# EAGLE design capacitive_switch (EAGLE 9.6.0)

## Sheet 1 of 2
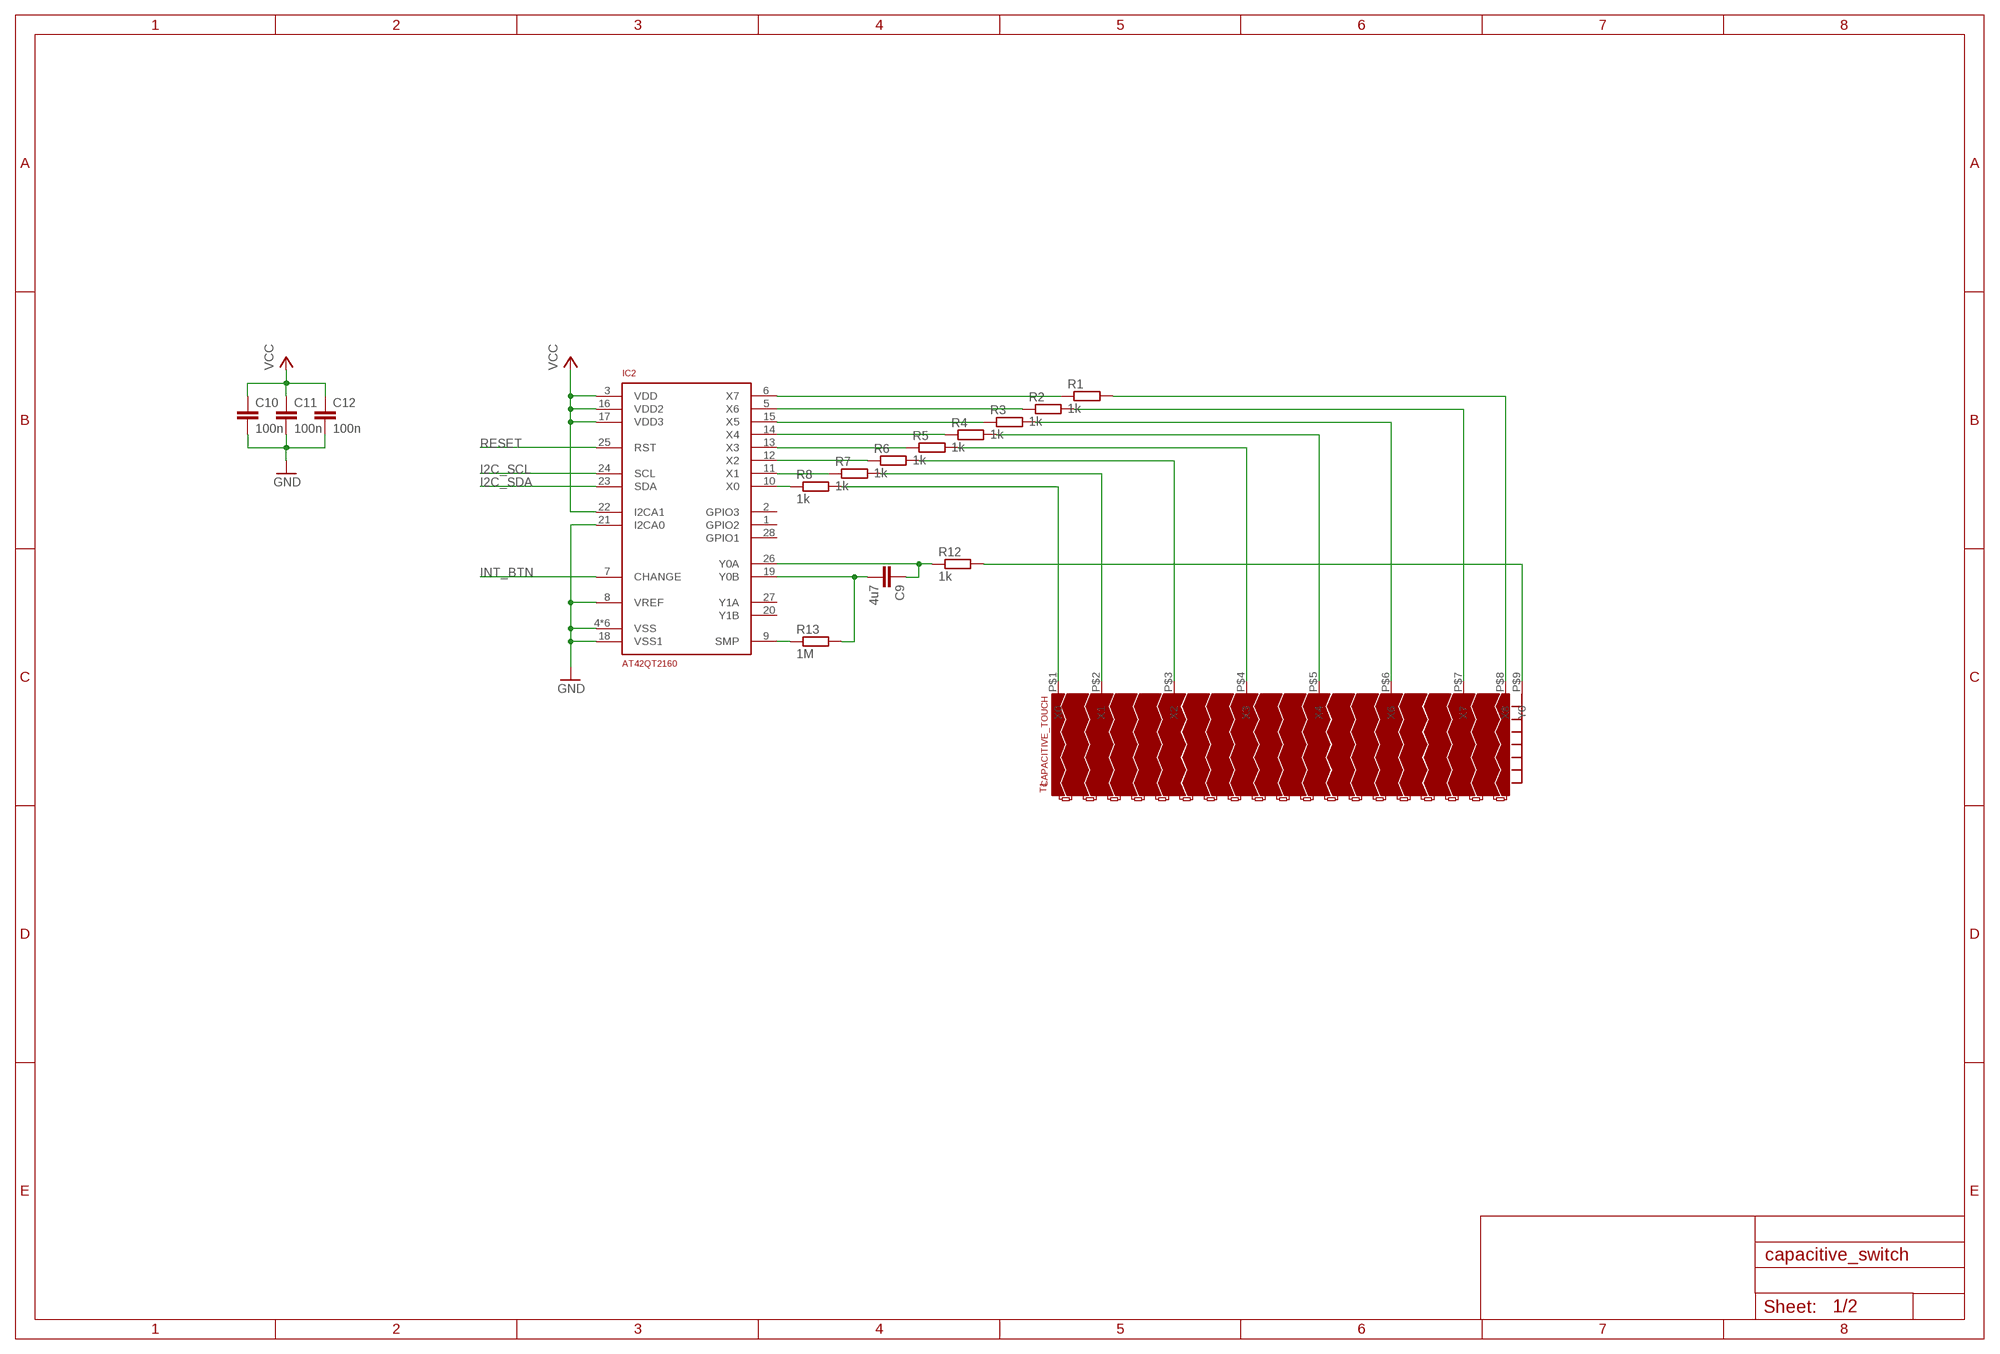
[diagram p0: schematic, sheet 1]

### Parts
C9  4u7  CAPACITOR0805  [C0805]
C10  100n  CAPACITOR0805  [C0805]
C11  100n  CAPACITOR0805  [C0805]
C12  100n  CAPACITOR0805  [C0805]
IC2  AT42QT2160  [QFN28_0.45MM_4X4MM]
R1  1k  RESISTOR0805  [R0805]
R2  1k  RESISTOR0805  [R0805]
R3  1k  RESISTOR0805  [R0805]
R4  1k  RESISTOR0805  [R0805]
R5  1k  RESISTOR0805  [R0805]
R6  1k  RESISTOR0805  [R0805]
R7  1k  RESISTOR0805  [R0805]
R8  1k  RESISTOR0805  [R0805]
R12  1k  RESISTOR0805  [R0805]
R13  1M  RESISTOR0805  [R0805]
T1  CAPACITIVE_TOUCH  [90X20_CAPACITIVE_TOUCH]

### Nets
GND: C10.2 C11.2 C12.2 IC2.4(VSS) IC2.8(VREF) IC2.18(VSS1) IC2.21(I2CA0) IC2.29(VSS) IC2.P$1(VSS) IC2.P$2(VSS) IC2.P$3(VSS) IC2.P$4(VSS) ; also sheet 2
I2C_SCL: IC2.24(SCL) ; also sheet 2
I2C_SDA: IC2.23(SDA) ; also sheet 2
INT_BTN: IC2.7(CHANGE) ; also sheet 2
N$2: R8.2 T1.P$1(X0)
N$7: R7.2 T1.P$2(X1)
N$8: R6.2 T1.P$3(X2)
N$9: R5.2 T1.P$4(X3)
N$10: R4.2 T1.P$5(X4)
N$11: R3.2 T1.P$6(X6)
N$12: R2.2 T1.P$7(X7)
N$13: R1.2 T1.P$8(X8)
N$14: R12.2 T1.P$9(Y0)
N$15: C9.1 IC2.26(Y0A) R12.1
N$25: IC2.10(X0) R8.1
N$26: IC2.11(X1) R7.1
N$27: IC2.12(X2) R6.1
N$28: IC2.13(X3) R5.1
N$29: IC2.14(X4) R4.1
N$30: IC2.15(X5) R3.1
N$31: IC2.5(X6) R2.1
N$32: IC2.6(X7) R1.1
N$34: C9.2 IC2.19(Y0B) R13.2
N$36: IC2.9(SMP) R13.1
RESET: IC2.25(RST) ; also sheet 2
VCC: C10.1 C11.1 C12.1 IC2.3(VDD) IC2.16(VDD2) IC2.17(VDD3) IC2.22(I2CA1) ; also sheet 2
Unconnected: IC2.1(GPIO2) IC2.2(GPIO3) IC2.20(Y1B) IC2.27(Y1A) IC2.28(GPIO1)

## Sheet 2 of 2
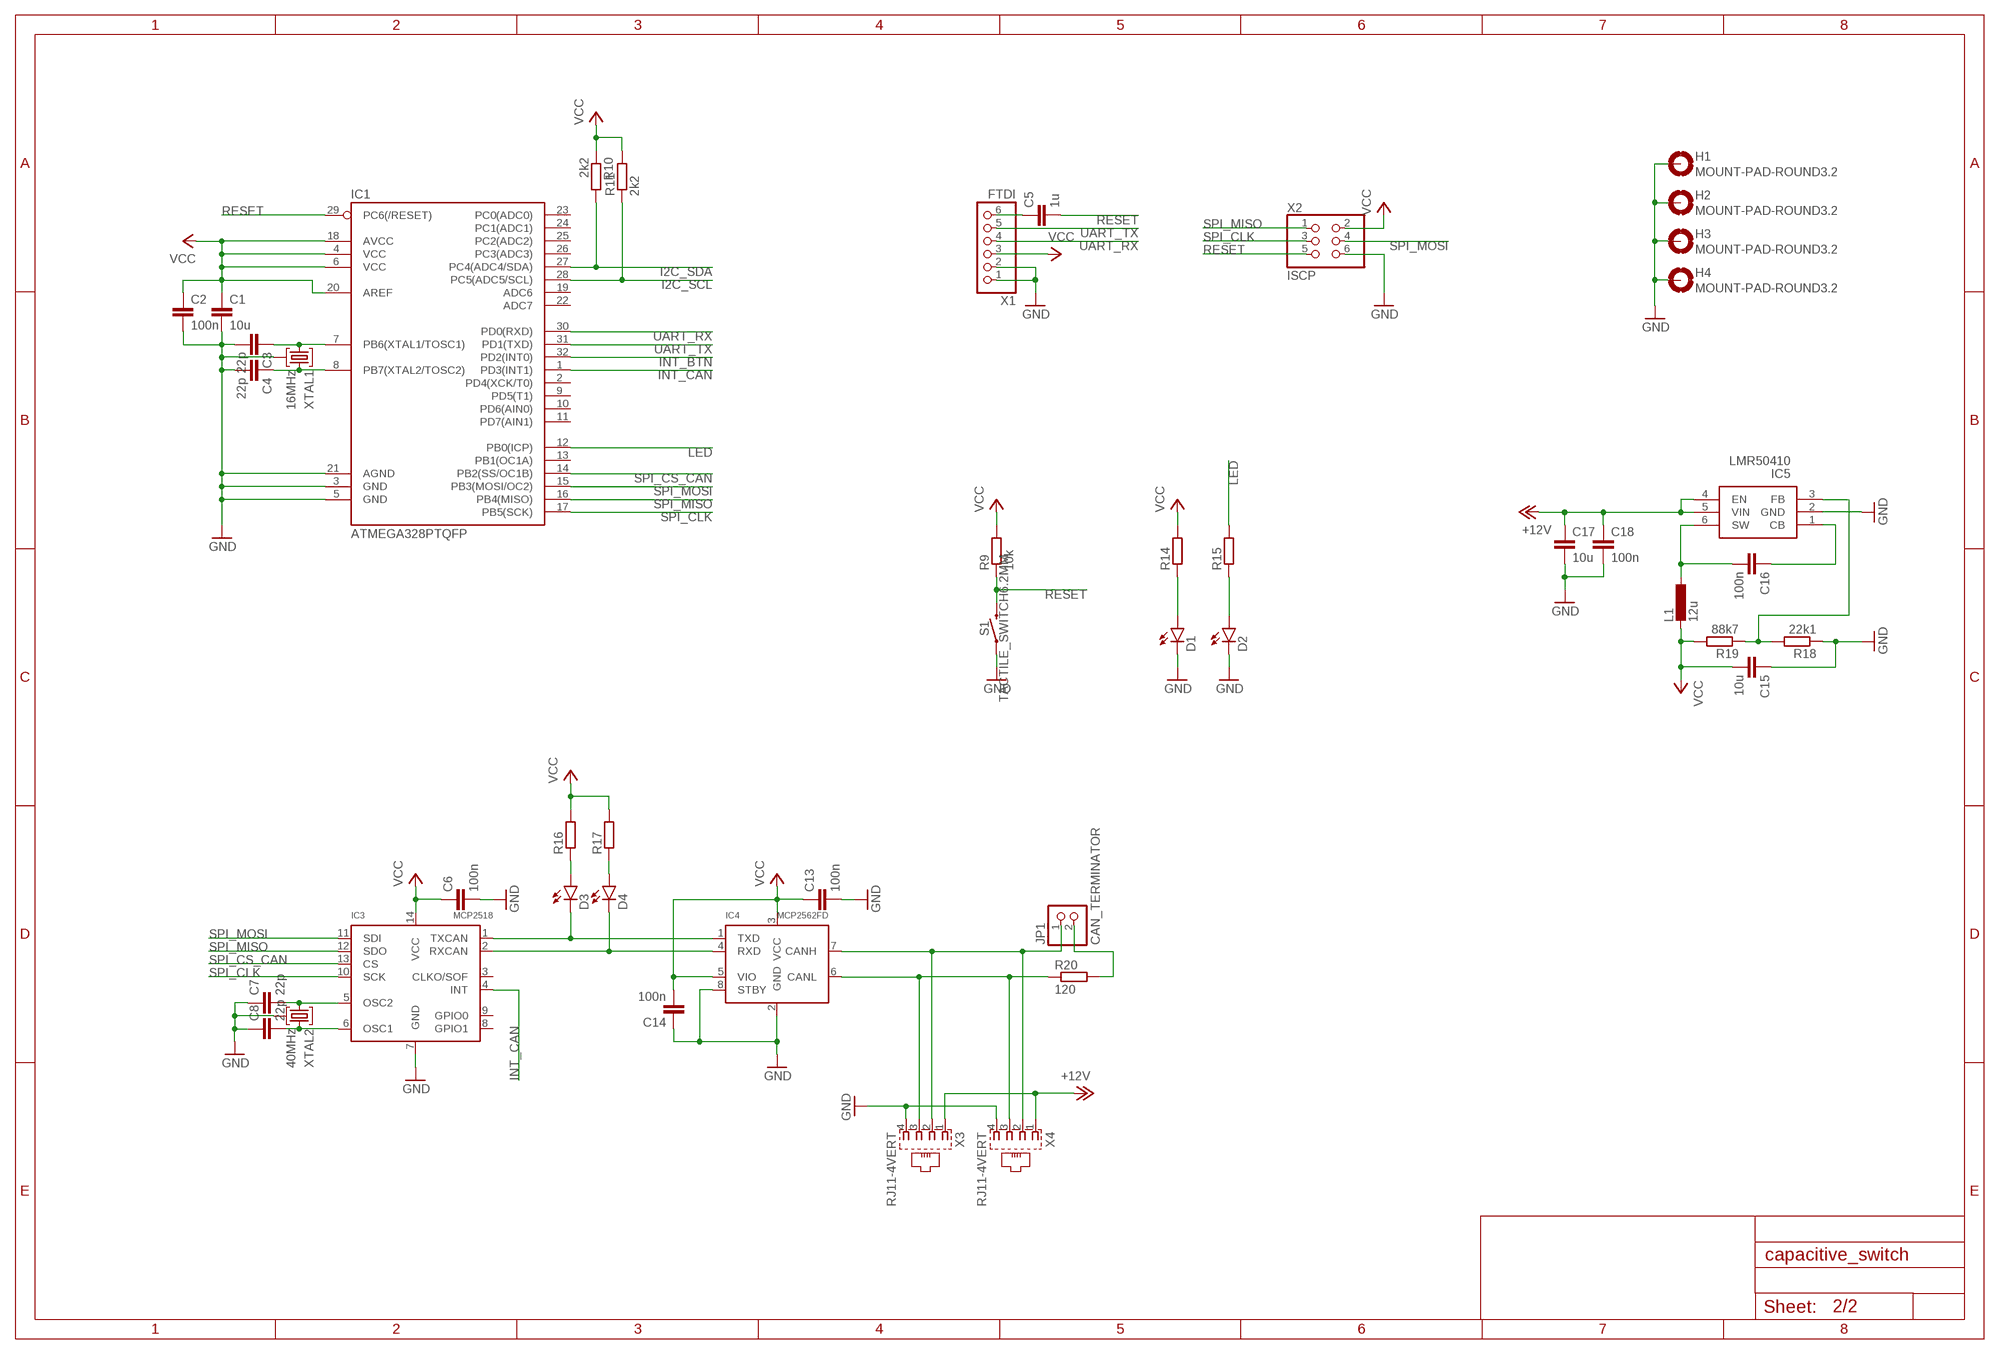
[diagram p1: schematic, sheet 2]

### Parts
C1  10u  CAPACITOR1206  [C1206]
C2  100n  CAPACITOR0805  [C0805]
C3  22p  CAPACITOR0805  [C0805]
C4  22p  CAPACITOR0805  [C0805]
C5  1u  CAPACITOR0805  [C0805]
C6  100n  CAPACITOR0805  [C0805]
C7  22p  CAPACITOR0805  [C0805]
C8  22p  CAPACITOR0805  [C0805]
C13  100n  CAPACITOR0805  [C0805]
C14  100n  CAPACITOR0805  [C0805]
C15  10u  CAPACITOR1206  [C1206]
C16  100n  CAPACITOR0805  [C0805]
C17  10u  CAPACITOR1206  [C1206]
C18  100n  CAPACITOR0805  [C0805]
D1  LED1206  [CHIPLED_1206]
D2  LED1206  [CHIPLED_1206]
D3  LED1206  [CHIPLED_1206]
D4  LED1206  [CHIPLED_1206]
H1  MOUNT-PAD-ROUND3.2  [3,2-PAD]
H2  MOUNT-PAD-ROUND3.2  [3,2-PAD]
H3  MOUNT-PAD-ROUND3.2  [3,2-PAD]
H4  MOUNT-PAD-ROUND3.2  [3,2-PAD]
IC1  ATMEGA328PTQFP  [TQFP32_0.8MM_7X7MM]
IC3  MCP2518  MCP2518FDSO14  [SO14]
IC4  MCP2562FD  MCP2562FDSO08  [SO08]
IC5  LMR50410  [SOT23-6]
JP1  CAN_TERMINATOR  PINHD-1X2  [1X02]
L1  12u  INDUCTOR7.3MM  [L_7.3MM]
R9  10k  RESISTOR0805  [R0805]
R10  2k2  RESISTOR0805  [R0805]
R11  2k2  RESISTOR0805  [R0805]
R14  RESISTOR0805  [R0805]
R15  RESISTOR0805  [R0805]
R16  RESISTOR0805  [R0805]
R17  RESISTOR0805  [R0805]
R18  22k1  RESISTOR0805  [R0805]
R19  88k7  RESISTOR0805  [R0805]
R20  120  RESISTOR0805  [R0805]
S1  TACTILE_SWITCH6.2MM  [TACTILE_SWITCH_SMD_6.2MM]
X1  FTDI  PINHD-1X6  [1X06]
X2  ISCP  PINHD-2X3  [2X03]
X3  RJ11-4VERT  [RJ11-4_VERT]
X4  RJ11-4VERT  [RJ11-4_VERT]
XTAL1  16MHz  CRYSTAL_GND5X3.2  [XTAL_5.0X3.2_4]
XTAL2  40MHz  CRYSTAL_GND5X3.2  [XTAL_5.0X3.2_4]

### Nets
+12V: C17.1 C18.1 IC5.4(EN) IC5.5(VIN) X3.1 X4.1
GND: C1.2 C2.2 C3.2 C4.2 C6.2 C7.1 C8.1 C13.2 C14.1 C15.1 C17.2 C18.2 D1.C D2.C H1.B3,2(MOUNT) H1.P$1(MOUNT) H1.P$2(MOUNT) H1.P$3(MOUNT) H1.P$4(MOUNT) H1.P$5(MOUNT) H1.P$6(MOUNT) H1.P$7(MOUNT) H1.P$8(MOUNT) H2.B3,2(MOUNT) H2.P$1(MOUNT) H2.P$2(MOUNT) H2.P$3(MOUNT) H2.P$4(MOUNT) H2.P$5(MOUNT) H2.P$6(MOUNT) H2.P$7(MOUNT) H2.P$8(MOUNT) H3.B3,2(MOUNT) H3.P$1(MOUNT) H3.P$2(MOUNT) H3.P$3(MOUNT) H3.P$4(MOUNT) H3.P$5(MOUNT) H3.P$6(MOUNT) H3.P$7(MOUNT) H3.P$8(MOUNT) H4.B3,2(MOUNT) H4.P$1(MOUNT) H4.P$2(MOUNT) H4.P$3(MOUNT) H4.P$4(MOUNT) H4.P$5(MOUNT) H4.P$6(MOUNT) H4.P$7(MOUNT) H4.P$8(MOUNT) IC1.3(GND) IC1.5(GND) IC1.21(AGND) IC3.7(GND) IC4.2(GND) IC4.8(STBY) IC5.2(GND) R18.1 S1.A1 S1.A2 X1.1 X1.2 X2.6 X3.4 X4.4 XTAL1.2 XTAL1.4 XTAL2.2 XTAL2.4 ; also sheet 1
I2C_SCL: IC1.28(PC5(ADC5/SCL)) R11.1 ; also sheet 1
I2C_SDA: IC1.27(PC4(ADC4/SDA)) R10.2 ; also sheet 1
INT_BTN: IC1.32(PD2(INT0)) ; also sheet 1
INT_CAN: IC1.1(PD3(INT1)) IC3.4(INT)
LED: IC1.12(PB0(ICP)) R15.2
N$1: D3.A R16.1
N$3: C3.1 IC1.7(PB6(XTAL1/TOSC1)) XTAL1.1
N$4: C4.1 IC1.8(PB7(XTAL2/TOSC2)) XTAL1.3
N$5: D4.A R17.1
N$6: C5.1 X1.6
N$16: IC4.6(CANL) R20.1 X3.3 X4.3
N$17: IC4.7(CANH) JP1.1 X3.2 X4.2
N$18: D3.C IC3.1(TXCAN) IC4.1(TXD)
N$19: D4.C IC3.2(RXCAN) IC4.4(RXD)
N$20: C7.2 IC3.5(OSC2) XTAL2.1
N$21: C8.2 IC3.6(OSC1) XTAL2.3
N$22: D1.A R14.1
N$23: D2.A R15.1
N$24: JP1.2 R20.2
N$125: C16.2 IC5.6(SW) L1.1
N$126: C16.1 IC5.1(CB)
N$127: IC5.3(FB) R18.2 R19.1
RESET: C5.2 IC1.29(PC6(/RESET)) R9.1 S1.B1 S1.B2 X2.5 ; also sheet 1
SPI_CLK: IC1.17(PB5(SCK)) IC3.10(SCK) X2.3
SPI_CS_CAN: IC1.14(PB2(SS/OC1B)) IC3.13(CS)
SPI_MISO: IC1.16(PB4(MISO)) IC3.12(SDO) X2.1
SPI_MOSI: IC1.15(PB3(MOSI/OC2)) IC3.11(SDI) X2.4
UART_RX: IC1.30(PD0(RXD)) X1.4
UART_TX: IC1.31(PD1(TXD)) X1.5
VCC: C1.1 C2.1 C6.1 C13.1 C14.2 C15.2 IC1.4(VCC) IC1.6(VCC) IC1.18(AVCC) IC1.20(AREF) IC3.14(VCC) IC4.3(VCC) IC4.5(VIO) L1.2 R9.2 R10.1 R11.2 R14.2 R16.2 R17.2 R19.2 X1.3 X2.2 ; also sheet 1
Unconnected: IC1.2(PD4(XCK/T0)) IC1.9(PD5(T1)) IC1.10(PD6(AIN0)) IC1.11(PD7(AIN1)) IC1.13(PB1(OC1A)) IC1.19(ADC6) IC1.22(ADC7) IC1.23(PC0(ADC0)) IC1.24(PC1(ADC1)) IC1.25(PC2(ADC2)) IC1.26(PC3(ADC3)) IC3.3(CLKO/SOF) IC3.8(GPIO1) IC3.9(GPIO0)

## Library data of the parts
C1-C18 = SMD:CAPACITOR
D1-D4 = SMD:LED
H1-H4 = THT:MOUNT-PAD-ROUND: MOUNTING PAD, round
IC1 = SMD:ATMEGA328P
IC2 = SMD:AT42QT2160
IC3 = SMD:MCP2518FD
IC4 = SMD:MCP2562FD
IC5 = SMD:LMR50410
JP1 = THT:PINHD-1X2: PIN HEADER
L1 = SMD:INDUCTOR
R1-R20 = SMD:RESISTOR
S1 = SMD:TACTILE_SWITCH
T1 = SMD:CAPACITIVE_TOUCH
X1 = THT:PINHD-1X6: PIN HEADER
X2 = THT:PINHD-2X3: PIN HEADER
X3 X4 = THT:RJ11-4
XTAL1 XTAL2 = SMD:CRYSTAL_GND

## Board
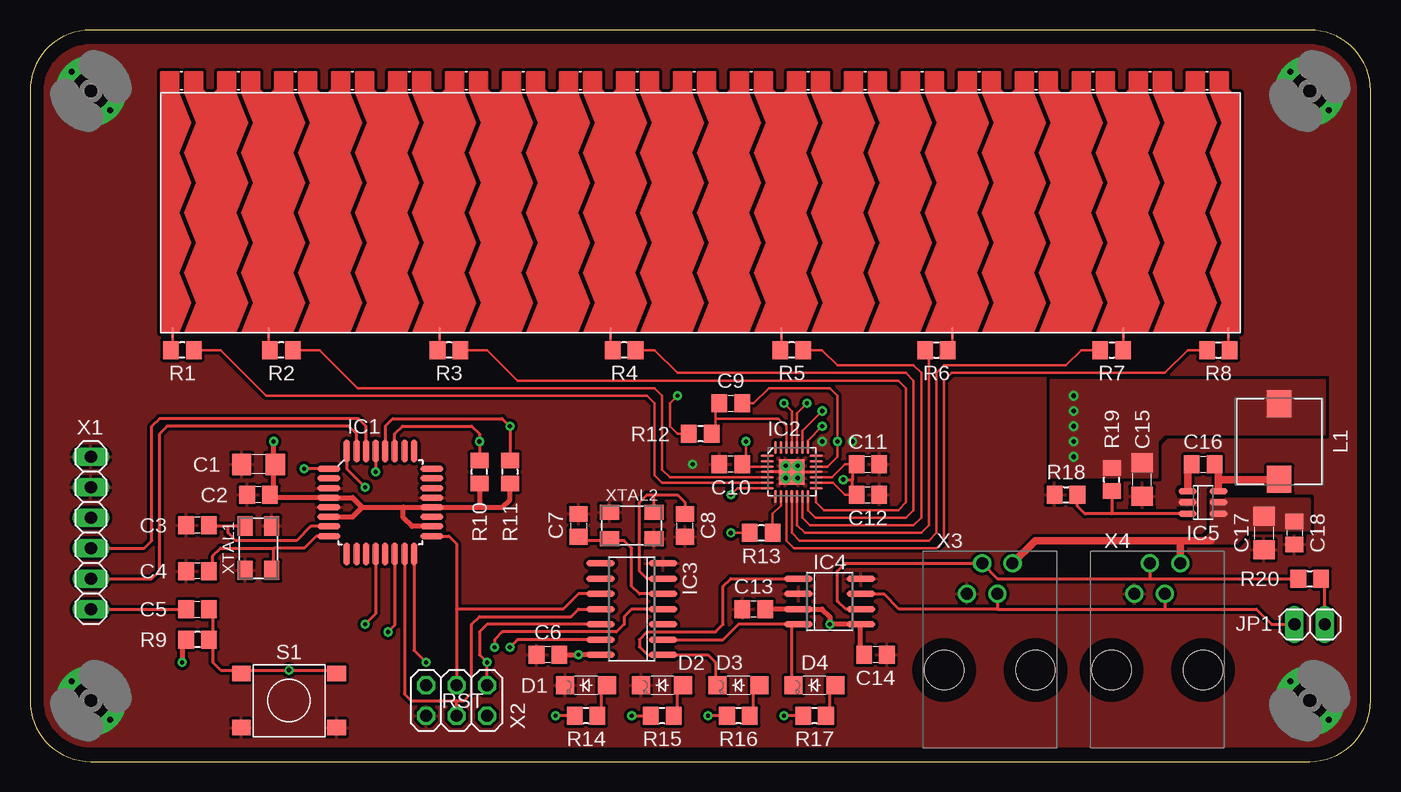
[diagram p2: board, top side]
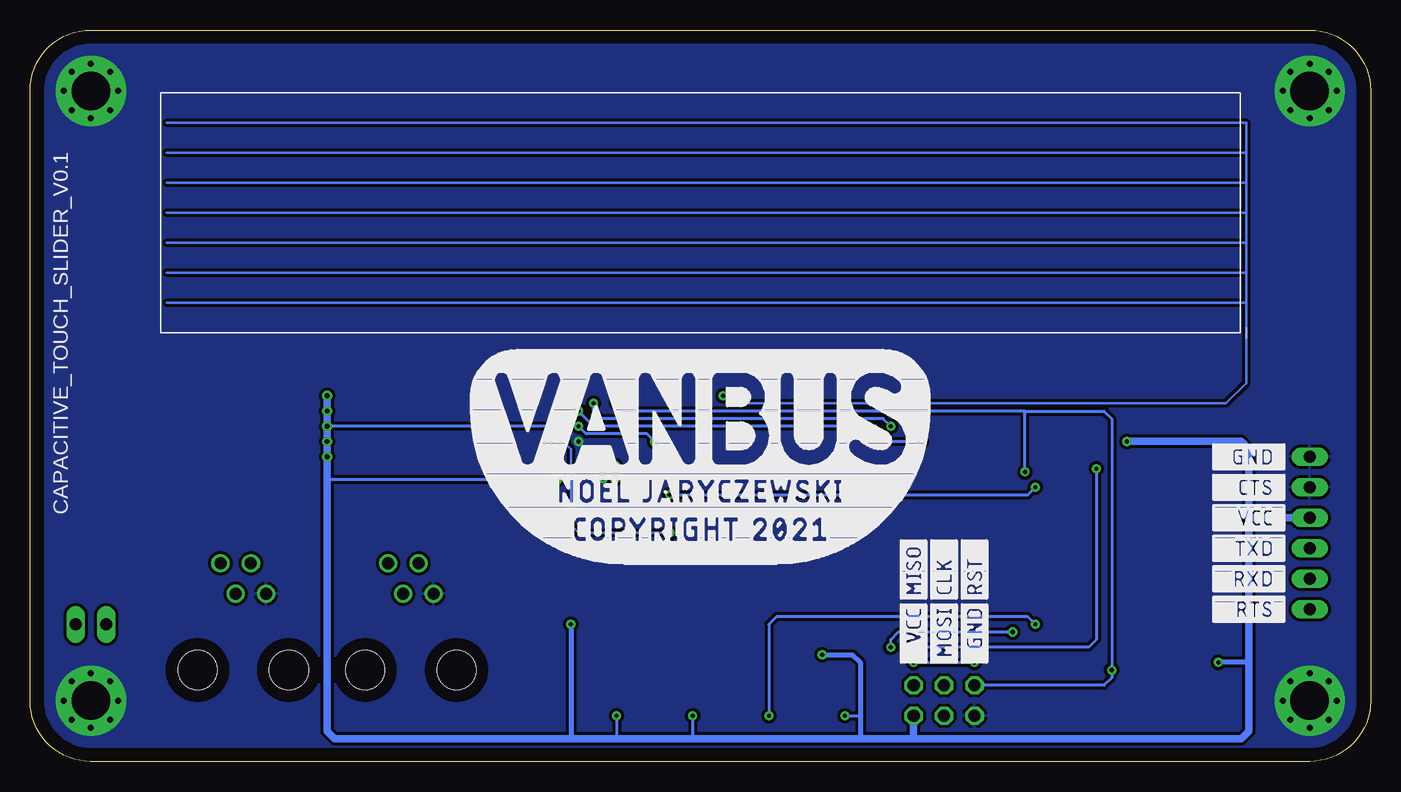
[diagram p3: board, bottom side, seen from below]

Size 111.76 x 60.96 mm. Coordinates in mm from the lower left corner, seen from the top.
Outline: 106.68,60.96 5.08,60.96 arc90 0,55.88 0,5.08 arc90 5.08,0 106.68,0 arc90 111.76,5.08 111.76,55.88 arc90 106.68,60.96
Copper layers (1*16): Top 0.035mm / dielectric 1.5mm / Bottom 0.035mm
Design rules "default *": minimum track width 6mil, minimum drill 0.35mm, track to track 6mil, track to pad 6mil, pad to pad 6mil, via to via 6mil, smd to smd 6mil, copper to edge 40mil, drill to drill 6mil, minimum pad ring 10mil, minimum via ring 8mil, stop-mask expansion 4mil, vias tented up to drill 16mil, thermal gap 10mil

### Footprints (pad centres in the part's own frame; a part is rotated, then mirrored left to right if it is on the bottom)
C1206 = smd 1.6 x 1.8: 1 -1.4,0; 2 1.4,0
C0805 = smd 1.3 x 1.5: 1 -0.95,0; 2 0.95,0
CHIPLED_1206 = smd 1.5 x 1.5: A 0,-1.75; C 0,1.75
3,2-PAD = drill 3.2 pad 5.842: B3,2 0,0 | drill 0.5: P$1 0,2.261; P$2 0,-2.261; P$3 2.261,0; P$4 -2.261,0; P$5 -1.598,1.598; P$6 1.598,1.598; P$7 -1.598,-1.598; P$8 1.598,-1.598
TQFP32_0.8MM_7X7MM = smd 1.905 x 0.559: 1 -4.293,2.8; 2 -4.293,2; 3 -4.293,1.2; 4 -4.293,0.4; 5 -4.293,-0.4; 6 -4.293,-1.2; 7 -4.293,-2; 8 -4.293,-2.8; 17 4.293,-2.8; 18 4.293,-2; 19 4.293,-1.2; 20 4.293,-0.4; 21 4.293,0.4; 22 4.293,1.2; 23 4.293,2; 24 4.293,2.8 | smd 0.559 x 1.905: 9 -2.8,-4.293; 10 -2,-4.293; 11 -1.2,-4.293; 12 -0.4,-4.293; 13 0.4,-4.293; 14 1.2,-4.293; 15 2,-4.293; 16 2.8,-4.293; 25 2.8,4.293; 26 2,4.293; 27 1.2,4.293; 28 0.4,4.293; 29 -0.4,4.293; 30 -1.2,4.293; 31 -2,4.293; 32 -2.8,4.293
QFN28_0.45MM_4X4MM = smd 1.067 x 0.203: 1 -2.032,1.35; 2 -2.032,0.9; 3 -2.032,0.45; 4 -2.032,0; 5 -2.032,-0.45; 6 -2.032,-0.9; 7 -2.032,-1.35; 15 2.032,-1.35; 16 2.032,-0.9; 17 2.032,-0.45; 18 2.032,0; 19 2.032,0.45; 20 2.032,0.9; 21 2.032,1.35 | smd 0.203 x 1.067: 8 -1.35,-2.032; 9 -0.9,-2.032; 10 -0.45,-2.032; 11 0,-2.032; 12 0.45,-2.032; 13 0.9,-2.032; 14 1.35,-2.032; 22 1.35,2.032; 23 0.9,2.032; 24 0.45,2.032; 25 0,2.032; 26 -0.45,2.032; 27 -0.9,2.032; 28 -1.35,2.032 | smd 2.1 x 2.1: 29 0,0 | drill 0.35 pad 0.61: P$1 -0.508,0.508; P$2 0.508,0.508; P$3 0.508,-0.508; P$4 -0.508,-0.508
SO14 = smd 0.559 x 2.388: 1 -3.81,-2.6; 2 -2.54,-2.6; 3 -1.27,-2.6; 4 0,-2.6; 5 1.27,-2.6; 6 2.54,-2.6; 7 3.81,-2.6; 8 3.81,2.6; 9 2.54,2.6; 10 1.27,2.6; 11 0,2.6; 12 -1.27,2.6; 13 -2.54,2.6; 14 -3.81,2.6
SO08 = smd 0.559 x 2.388: 1 -1.905,-2.6; 2 -0.635,-2.6; 3 0.635,-2.6; 4 1.905,-2.6; 5 1.905,2.6; 6 0.635,2.6; 7 -0.635,2.6; 8 -1.905,2.6
SOT23-6 = smd 0.559 x 1.524: 1 0.95,1.3; 2 0,1.3; 3 -0.95,1.3; 4 -0.95,-1.3; 5 0,-1.3; 6 0.95,-1.3
1X02 = drill 1.016 long: 1 -1.27,0; 2 1.27,0
L_7.3MM = smd 2.25 x 2.05: 1 -3.15,0; 2 3.15,0
R0805 = smd 1.3 x 1.5: 1 -0.95,0; 2 0.95,0
TACTILE_SWITCH_SMD_6.2MM = smd 1.55 x 1.3: A1 -3.975,-2.25; A2 3.975,-2.25; B1 -3.975,2.25; B2 3.975,2.25
90X20_CAPACITIVE_TOUCH = smd 0.203 x 1.016: P$1 -44,10; P$2 -35.25,10; P$3 -21,10; P$4 -6.75,10; P$5 7.5,10; P$6 21.75,10; P$7 36,10; P$8 44,10 | smd 0.203 x 1.016 bottom: P$9 45.5,10
1X06 = drill 1.016 long: 1 -6.35,0; 2 -3.81,0; 3 -1.27,0; 4 1.27,0; 5 3.81,0; 6 6.35,0
2X03 = drill 1.016 octagon: 1 -2.54,-1.27; 2 -2.54,1.27; 3 0,-1.27; 4 0,1.27; 5 2.54,-1.27; 6 2.54,1.27
RJ11-4_VERT = drill 1: 1 -1.905,-8.89; 2 -0.635,-6.35; 3 0.635,-8.89; 4 1.905,-6.35 | hole 3.25: -3.81,0; 3.81,0
XTAL_5.0X3.2_4 = smd 1.6 x 1.25: 1 -1.85,-1.1; 2 1.85,-1.1; 3 1.85,1.1; 4 -1.85,1.1

### Placement (x,y rotation side)
C1  19.05,24.77 180 top
C2  19.05,22.23 180 top
C3  13.97,19.68 180 top
C4  13.97,15.88 180 top
C5  13.97,12.7 0 top
C6  43.18,8.89 180 top
C7  45.72,19.68 270 top
C8  54.61,19.68 90 top
C9  58.42,29.84 0 top
C10  58.42,24.77 180 top
C11  69.85,24.77 0 top
C12  69.85,22.23 0 top
C13  60.33,12.7 180 top
C14  70.48,8.89 180 top
C15  92.71,23.5 90 top
C16  97.79,24.77 0 top
C17  102.87,19.05 270 top
C18  105.41,19.05 270 top
D1  46.35,6.35 90 top
D2  52.7,6.35 90 top
D3  59.05,6.35 90 top
D4  65.41,6.35 90 top
H1  106.68,55.88 0 top
H2  5.08,55.88 0 top
H3  106.68,5.08 0 top
H4  5.08,5.08 0 top
IC1  29.21,21.59 0 top
IC2  63.5,24.13 0 top
IC3  50.16,12.7 90 top
IC4  66.67,13.34 270 top
IC5  97.79,21.59 90 top
JP1  106.68,11.43 0 top
L1  104.14,26.67 90 top
R1  12.7,34.29 180 top
R2  20.95,34.29 180 top
R3  34.92,34.29 180 top
R4  49.53,34.29 180 top
R5  63.5,34.29 180 top
R6  75.56,34.29 0 top
R7  90.17,34.29 0 top
R8  99.06,34.29 0 top
R9  13.97,10.16 180 top
R10  37.47,24.13 90 top
R11  40.01,24.13 270 top
R12  55.88,27.3 180 top
R13  60.96,19.05 180 top
R14  46.35,3.81 180 top
R15  52.7,3.81 180 top
R16  59.05,3.81 180 top
R17  65.41,3.81 180 top
R18  86.36,22.23 0 top
R19  90.17,23.5 90 top
R20  106.68,15.24 0 top
S1  21.59,5.08 0 top
T1  55.88,45.72 180 top
X1  5.08,19.05 270 top
X2  35.56,5.08 180 top
X3  80.01,7.62 180 top
X4  93.98,7.62 180 top
XTAL1  19.05,17.78 270 top
XTAL2  50.16,19.68 0 top

### Tracks (layer width: path | path; a pad name or v marks a point on that pad's centre or on a via)
+12V
  Top 0.61: 98.42,18.41 95.89,18.41 | 95.89,18.41 83.82,18.41 X3.1 | C18.1 105.72,19.68 | X4.1 95.89,18.41
  pour Top (isolate 0.254, no thermals): 98.42,21.84 98.42,19.05 97.79,18.41 97.79,18.24 100.58,18.24 101.65,19.3 106.68,19.3 106.68,21.84
GND  (via drill 0.35)
  Top 0.203: IC2.29 IC2.P$4
  Top 0.254: IC2.4 IC2.29 IC2.18
  other vias: 66.04,26.67 68.58,26.67 55.24,24.77
  pour Top (isolate 0.254, rank 2): 110.49,55.88 110.49,5.08 arc-90 106.68,1.27 5.08,1.27 arc-90 1.27,5.08 1.27,55.88 arc-90 5.08,59.69 106.68,59.69 arc-90
  pour Bottom (isolate 0.254, rank 2): 1.27,5.08 1.27,55.88 arc-90 5.08,59.69 106.68,59.69 arc-90 110.49,55.88 110.49,5.08 arc-90 106.68,1.27 5.08,1.27 arc-90
  pour Top (no thermals): 95.25,21.84 97.79,21.84 97.79,21.34 95.25,21.34
I2C_SCL  (via drill 0.35)
  Top 0.203: IC2.24 63.95,29.02 v64.77,29.84
  Top 0.254: R11.1 v40.01,27.94 39.37,28.57 30.25,28.57 29.61,27.94 IC1.28
  Bottom 0.254: v40.01,27.94 40.64,28.57 64.14,28.57 64.77,29.21 v64.77,29.84
I2C_SDA  (via drill 0.35)
  Top 0.203: IC2.23 64.4,27.57 v66.04,29.21
  Top 0.254: IC1.27 30.41,27.3 31.05,27.94 36.83,27.94 37.47,27.3 v37.47,26.67 R10.2
  Bottom 0.254: v37.47,26.67 40.01,26.67 41.27,27.94 64.77,27.94 v66.04,29.21
INT_BTN  (via drill 0.35)
  Top 0.203: IC2.7 58.98,22.78 v58.42,22.23
  Top 0.254: IC1.32 26.41,24.39 v27.94,22.86
  Bottom 0.254: v27.94,22.86 28.57,22.23 v58.42,22.23
INT_CAN  (via drill 0.35)
  Top 0.254: IC1.1 v22.86,24.39 | IC3.4 50.16,12.7 49.53,12.06 49.53,11.43 48.9,10.79 39.37,10.79 38.73,10.16 v38.73,9.53
  Bottom 0.254: v22.86,24.39 22.86,10.16 23.5,9.53 v38.73,9.53
LED  (via drill 0.35)
  Top 0.254: IC1.12 28.81,12.3 v27.94,11.43 | v50.16,3.81 R15.2
  Bottom 0.254: v27.94,11.43 28.57,12.06 49.53,12.06 50.16,11.43 v50.16,3.81
N$1
  Top 0.254: R16.1 60.01,4.12 60.33,4.45 60.33,5.87 D3.A
N$2
  Top 0.203: T1.P$1 99.88,34.42 R8.2
N$3
  Top 0.254: C3.1 14.97,19.63 16.51,19.63 | 16.51,19.63 XTAL1.1 | IC1.7 23.4,19.59 22.23,18.41 17.14,18.41 16.51,19.05 16.51,19.63
N$4
  Top 0.254: C4.1 14.92,16.19 15.24,16.51 15.24,17.14 15.88,17.78 20.32,17.78 | XTAL1.3 20.15,16.34 20.32,16.51 20.32,17.78 | IC1.8 23.87,18.79 22.86,17.78 20.32,17.78
N$5
  Top 0.254: R17.1 66.36,4.12 66.67,4.45 66.67,5.87 D4.A
N$6
  Top 0.254: X1.6 C5.1
N$7
  Top 0.203: T1.P$2 R7.2
N$8
  Top 0.203: T1.P$3 76.88,34.66 R6.2
N$9
  Top 0.203: T1.P$4 62.63,34.37 R5.2
N$10
  Top 0.203: T1.P$5 48.38,34.49 R4.2
N$11
  Top 0.203: T1.P$6 34.13,34.45 R3.2
N$12
  Top 0.203: T1.P$7 19.88,34.41 R2.2
N$13
  Top 0.203: T1.P$8 11.88,34.42 R1.2
N$14  (via drill 0.35)
  Top 0.203: R12.2 53.98,27.3 53.34,27.94 53.34,29.84 v53.98,30.48
  Bottom 0.203: T1.P$9 10.38,31.53 12.06,29.84 53.34,29.84 v53.98,30.48
N$15
  Top 0.203: IC2.26 63.05,27.94 62.41,28.57 57.15,28.57 | C9.1 57.47,29.53 57.15,29.21 57.15,28.57 | R12.1 56.83,27.62 57.15,27.94 57.15,28.57
N$16
  Top 0.254: IC4.6 68,12.7 67.37,13.34 67.31,13.34 67.31,15.88 67.94,16.51 X3.3 80.64,15.24 93.34,15.24 | 93.34,15.24 R20.1 | X4.3 93.34,15.24
N$17
  Top 0.254: IC4.7 71.18,13.97 72.45,12.7 80.64,12.7 | 80.64,12.7 94.61,12.7 | 94.61,12.7 102.23,12.7 103.5,11.43 JP1.1 | X3.2 80.64,12.7 | X4.2 94.61,12.7
N$18
  Top 0.254: D3.C 57.15,6.35 57.15,8.26 56.52,8.89 IC3.1 51.49,8.89 50.86,9.53 50.8,9.53 50.8,10.16 51.44,10.79 57.15,10.79 57.78,11.43 57.78,14.61 58.42,15.24 IC4.1
N$19
  Top 0.254: IC4.4 63.5,11.43 | 63.5,11.43 59.05,11.43 57.78,10.16 IC3.2 | D4.C 63.5,6.5 63.5,11.43
N$20
  Top 0.254: IC3.5 50.8,13.97 50.16,14.61 50.16,17.78 49.53,18.41 48.48,18.41 XTAL2.1 48.15,18.41 46.04,18.41 C7.2
N$21
  Top 0.254: IC3.6 51.44,15.24 50.8,15.88 50.8,21.59 51.44,22.23 52.07,22.23 | 52.07,22.23 53.98,22.23 54.61,21.59 C8.2 | XTAL2.3 52.02,22.17 52.07,22.23
N$22
  Top 0.254: R14.1 47.3,4.12 47.62,4.45 47.62,5.87 D1.A
N$23
  Top 0.254: R15.1 53.66,4.12 53.98,4.45 53.98,5.87 D2.A
N$24
  Top 0.254: R20.2 107.95,14.92 JP1.2
N$25
  Top 0.203: R8.1 96.52,34.29 94.61,32.38 76.83,32.38 76.2,31.75 76.2,18.41 75.56,17.78 63.69,17.78 63.05,18.41 IC2.10
N$26
  Top 0.203: R7.1 87.63,34.29 86.36,33.02 76.2,33.02 75.56,32.38 75.56,19.05 74.93,18.41 64.14,18.41 63.5,19.05 IC2.11
N$27
  Top 0.203: R6.1 74.93,33.98 74.93,19.68 74.3,19.05 64.58,19.05 63.95,19.68 IC2.12
N$28
  Top 0.203: R5.1 66.04,34.29 67.31,33.02 73.66,33.02 74.3,32.38 74.3,20.32 73.66,19.68 65.03,19.68 64.4,20.32 IC2.13
N$29
  Top 0.203: R4.1 52.07,34.29 53.98,32.38 73.03,32.38 73.66,31.75 73.66,20.95 73.03,20.32 65.48,20.32 64.85,20.95 IC2.14
N$30
  Top 0.203: R3.1 38.1,34.29 40.64,31.75 72.39,31.75 73.03,31.11 73.03,21.59 72.39,20.95 66.17,20.95 65.53,21.59 IC2.15
N$31
  Top 0.203: R2.1 24.13,34.29 27.3,31.11 52.07,31.11 52.7,30.48 52.7,24.32 53.34,23.68 IC2.5
N$32
  Top 0.203: R1.1 15.88,34.29 19.68,30.48 51.44,30.48 52.07,29.84 52.07,23.86 52.7,23.23 IC2.6
N$34  (via drill 0.35)
  Top 0.203: IC2.19 66.49,24.58 67.31,25.4 v67.31,26.67 67.31,30.48 66.67,31.11 61.59,31.11 60.33,29.84 C9.2 | v58.42,19.05 R13.2
  Bottom 0.203: v67.31,26.67 66.67,26.04 66.67,19.68 66.04,19.05 v58.42,19.05
N$36
  Top 0.203: IC2.9 62.6,21.32 61.91,20.64 R13.1
N$125
  Top 0.254: 99.06,22.57 IC5.6 | C16.2 99.06,24.45 | L1.1 104.11,23.5
  Top 0.61: 99.06,24.45 99.06,23.5 | 99.06,23.5 99.06,22.57 | 104.11,23.5 99.06,23.5
N$126
  Top 0.254: 96.52,22.57 IC5.1
  Top 0.61: C16.1 96.84,24.45 96.52,24.13 96.52,22.57
N$127
  Top 0.254: IC5.3 90.17,20.64 | 90.17,20.64 87.94,20.64 87.31,21.27 R18.2 | R19.1 90.17,20.64
RESET  (via drill 0.35)
  Top 0.203: IC2.25 63.5,29.21 v62.87,29.84
  Top 0.254: C5.2 15.24,12.38 15.24,10.48 R9.1 15.24,9.84 15.24,8.26 15.88,7.62 17.32,7.62 S1.B1 17.91,7.62 v21.59,7.62 25.4,7.62 25.57,7.46 S1.B2 | IC1.29 v28.81,24.13
  Bottom 0.254: v28.81,24.13 28.81,29.21 | 28.81,29.21 62.23,29.21 v62.87,29.84 | X2.5 22.23,6.35 21.59,6.99 v21.59,7.62 21.59,28.57 22.23,29.21 28.81,29.21
SPI_CLK
  Top 0.254: IC3.10 45.72,13.97 44.45,12.7 35.56,12.7 | 35.56,12.7 X2.3 | IC1.17 34.92,18.79 35.56,18.16 35.56,12.7
SPI_CS_CAN  (via drill 0.35)
  Top 0.254: IC1.14 30.41,11.36 v29.84,10.79 | IC3.13 40.64,10.16 v40.01,9.53
  Bottom 0.254: v40.01,9.53 40.01,10.16 39.37,10.79 v29.84,10.79
SPI_MISO  (via drill 0.35)
  Top 0.254: IC3.12 38.1,11.43 37.47,10.79 37.47,8.89 v38.1,8.26 X2.1 | IC1.16 32.01,9.27 v33.02,8.26
  Bottom 0.254: v38.1,8.26 v33.02,8.26
SPI_MOSI
  Top 0.254: IC1.15 31.21,5.62 31.75,5.08 35.56,5.08 | 35.56,5.08 36.2,5.08 36.83,5.71 36.83,11.43 37.47,12.06 45.09,12.06 45.72,12.7 IC3.11 | X2.4 35.56,5.08
UART_RX
  Top 0.254: X1.4 9.53,17.78 10.16,18.41 10.16,27.94 10.79,28.57 27.38,28.57 28.01,27.94 IC1.30
UART_TX
  Top 0.254: X1.5 10.16,15.24 10.79,15.88 10.79,27.3 11.43,27.94 26.57,27.94 27.21,27.3 IC1.31
VCC  (via drill 0.35, 0.4)
  Top 0.203: IC2.17 66.86,23.68 67.94,24.77 C11.1 68.58,24.45 | IC2.16 66.94,23.23 67.94,22.23 68.58,22.23 C12.1 | IC2.3 59.24,24.58 59.05,24.77 | 59.05,24.77 C10.1 | IC2.22 64.85,26.75 v66.04,27.94 | v59.69,26.67 59.69,25.4 59.05,24.77
  Top 0.254: 20.23,21.99 C2.1 20,22.54 20.32,22.86 | C1.1 20.32,24.89 | 68.58,24.45 68.58,23.5 | 68.58,22.23 68.58,23.5 | v67.79,23.5 68.58,23.5 | R16.2 v56.52,3.81 | R17.2 v62.87,3.81 | R14.2 v43.81,3.81
  Top 0.406: 20.23,21.99 IC1.4 26.91,21.99 27.7,21.19 | 27.7,21.19 31.11,21.19 | 31.11,21.19 IC1.20 37.47,21.19 | IC1.6 26.91,20.39 27.7,21.19 | IC1.18 31.84,19.59 31.11,20.32 31.11,21.19 | C1.1 20.32,24.64 20.32,22.86 | 20.32,24.89 v20.32,26.67 | R9.2 12.7,10.16 v12.7,8.26 | R11.2 40.01,21.82 39.37,21.19 37.47,21.19 | R10.1 37.47,21.19 | C6.1 v45.72,8.89 IC3.14 | C13.1 IC4.3 66.04,12.7 66.67,12.06 v66.67,11.43 IC4.5 69.22,11.37 69.22,9.53 69.53,9.21 C14.2
  Bottom 0.254: v67.79,23.5 87,23.5 | v59.69,26.67 60.33,27.3 65.41,27.3 v66.04,27.94 v87,27.94 | v56.52,3.81 56.52,1.91 | v62.87,3.81 62.87,1.91 | v43.81,3.81 42.55,3.81
  Bottom 0.406: 10.16,8.26 v12.7,8.26 | v45.72,8.89 43.18,8.89 42.55,8.26 42.55,3.81 42.55,1.91 | v66.67,11.43 66.67,1.91
  Bottom 0.61: 38.1,1.91 10.79,1.91 10.16,2.54 10.16,8.26 10.16,20.32 | 10.16,20.32 X1.3 | 38.1,1.91 42.55,1.91 56.52,1.91 62.87,1.91 66.67,1.91 86.36,1.91 87,2.54 87,23.5 v87,25.4 v87,26.67 v87,27.94 v87,29.21 v87,30.48 | 10.16,20.32 10.16,26.04 10.79,26.67 v20.32,26.67 | 38.1,1.91 X2.2
  pour Top (isolate 0.254, no thermals): 85.09,23.75 93.98,23.75 93.98,26.67 94.61,27.3 107.95,27.3 107.95,31.75 85.09,31.75

### Text on the board
tPlace: RST
bPlace: CAPACITIVE_TOUCH_SLIDER_V0.1